# Altium schematic sheet BG95_Power.SchDoc: BG95 Power Domain
size A4; DocumentNumber: 17; SheetNumber: 17; SheetTotal: 50
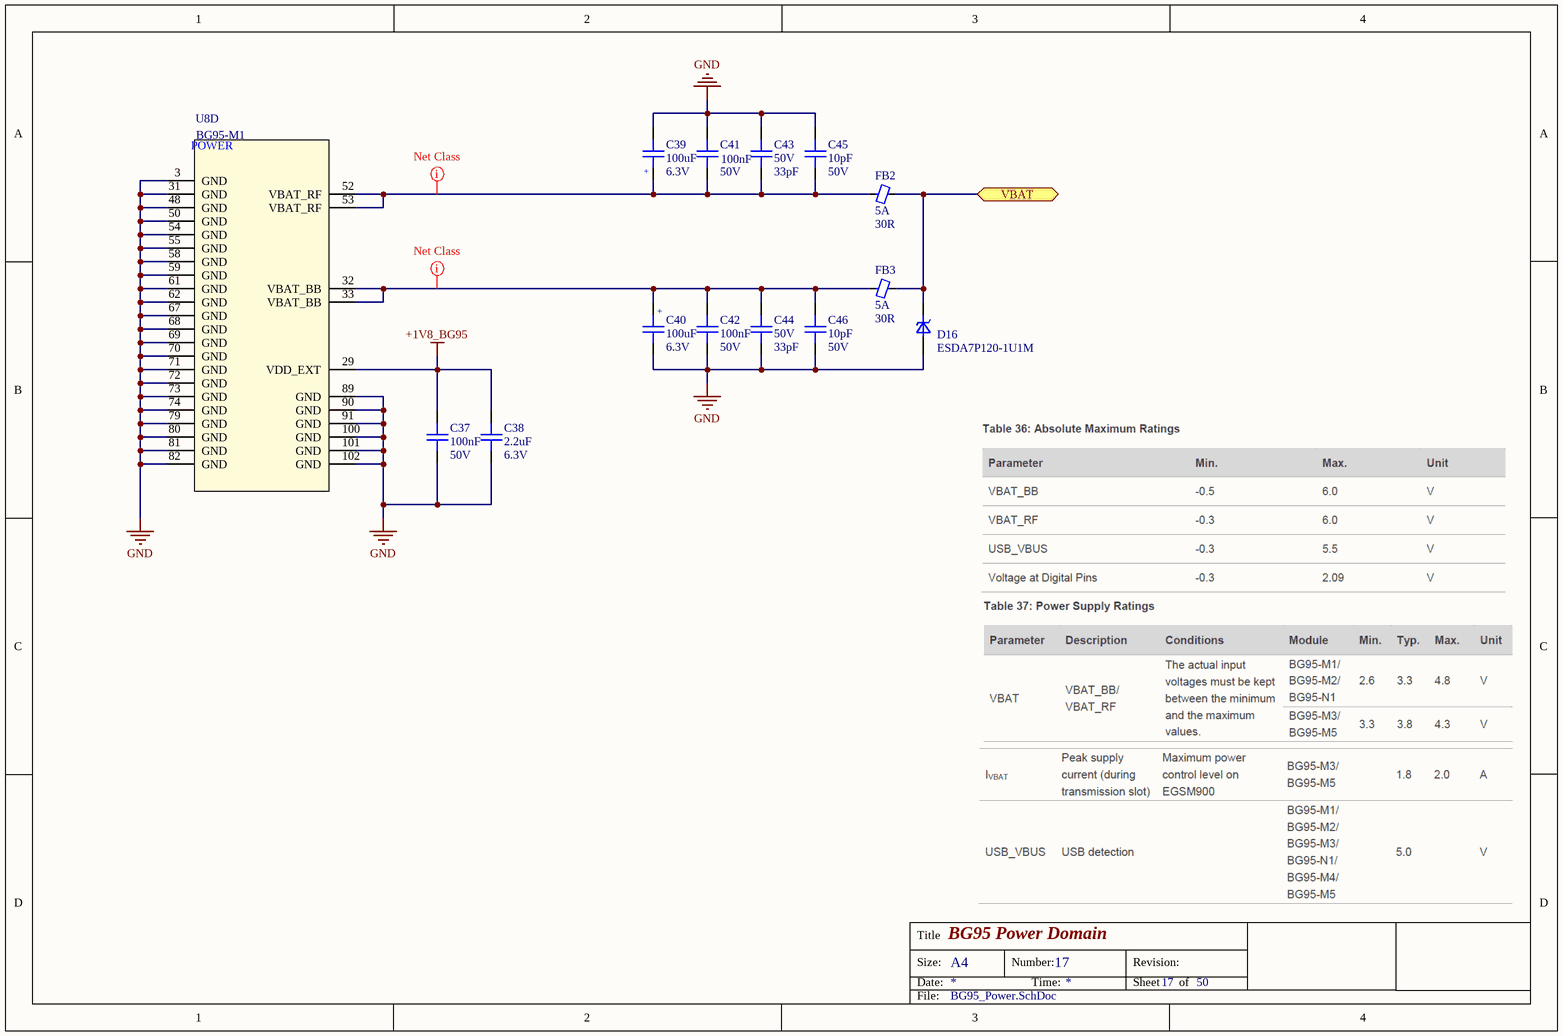
[diagram p0: BG95_Power.SchDoc]

## Parts
C37  Capacitance: 100nF  Voltage: 50V  [C0402]  (hidden comment: CAP CER 0.1UF 50V X7R 0402)
C38  Capacitance: 2.2uF  Voltage: 6.3V  [C0402]  (hidden comment: CAP CER 2.2UF 6.3V X5R 0402)
C39  Capacitance: 100uF  Voltage Rating: 6.3V  [WCAP-ASLI_5x5.5]  (hidden comment: CAP ALUM 100 UF 20% 6.3 V SMD)
C40  Capacitance: 100uF  Voltage Rating: 6.3V  [WCAP-ASLI_5x5.5]  (hidden comment: CAP ALUM 100 UF 20% 6.3 V SMD)
C41  Capacitance: 100nF  Voltage: 50V  [C0402]  (hidden comment: CAP CER 0.1UF 50V X7R 0402)
C42  Capacitance: 100nF  Voltage: 50V  [C0402]  (hidden comment: CAP CER 0.1UF 50V X7R 0402)
C43  Voltage Rating: 50V  Capacitance: 33pF  [C0402]  (hidden comment: CAP CER 33PF 50V C0G/NPO 0402)
C44  Voltage Rating: 50V  Capacitance: 33pF  [C0402]  (hidden comment: CAP CER 33PF 50V C0G/NPO 0402)
C45  Capacitance: 10pF  Voltage Rating: 50V  [C0402]  (hidden comment: CAP CER 10PF 50V C0G/NP0 0402)
C46  Capacitance: 10pF  Voltage Rating: 50V  [C0402]  (hidden comment: CAP CER 10PF 50V C0G/NP0 0402)
D16  ESDA7P120-1U1M  [ST_QFN_1610]
FB2  Current Rating: 5A  Impedance: 30R  [L0603]  (hidden comment: MPZ1608S300ATAH0)
FB3  Current Rating: 5A  Impedance: 30R  [L0603]  (hidden comment: MPZ1608S300ATAH0)
U8  BG95-M1  [BG95]  (part D of 6)

## Ports
VBAT

## Nets
+1V8_BG95: C37.2 C38.2 U8.29(VDD_EXT)
GND: C37.1 C38.1 C39.2 C40.2 C41.2 C42.1 C43.2 C44.1 C45.2 C46.1 D16.2(A) U8.3(GND) U8.31(GND) U8.48(GND) U8.50(GND) U8.54(GND) U8.55(GND) U8.58(GND) U8.59(GND) U8.61(GND) U8.62(GND) U8.67(GND) U8.68(GND) U8.69(GND) U8.70(GND) U8.71(GND) U8.72(GND) U8.73(GND) U8.74(GND) U8.79(GND) U8.80(GND) U8.81(GND) U8.82(GND) U8.89(GND) U8.90(GND) U8.91(GND) U8.100(GND) U8.101(GND) U8.102(GND)
VBAT: D16.1(K) FB2.2 FB3.2 ; port VBAT
NetC39_1: C39.1 C41.1 C43.1 C45.1 FB2.1 U8.52(VBAT_RF) U8.53(VBAT_RF)
NetC40_1: C40.1 C42.2 C44.2 C46.2 FB3.1 U8.32(VBAT_BB) U8.33(VBAT_BB)

## Layout directives
net class BG95_PWR: NetC39_1, NetC40_1

## Notes on the sheet
- Title
- Size:
- Date:
- A4
- Number:
- Time:
- Revision:
- Sheet
- of
- File:
- (in symbol CAP ALUM 100 UF 20% 6.3 V SMD) +
- (in symbol MOD BG95 RX TXRX CELLULAR LTE/NAV SMD, part D) POWER

## Library data of the parts
C37 C41 C42 = CAP CER 0.1UF 50V X7R 0402: 0.1µF ±10% 50V Ceramic Capacitor X7R 0402 (1005 Metric); Manufacturer: TDK; Manufacturer Part Number: CGA2B3X7R1H104K050BB; Supplier 1: Digi-Key; Stock 1: 2925303; Pricing 1: 1=0.17, 10=0.118, 50=0.0668, 100=0.0553, 500=0.0388, 1000=0.0321, 2500=0.0299, 5000=0.0273 (USD); Mount: Surface Mount; Case/Package: 0402; Weight: 2.3E-05oz; Case Code (Metric): 1005; Case Code (Imperial): 0402; Min Operating Temperature: -55°C; Max Operating Temperature: 125°C; Voltage Rating: 50V; Tolerance: 10%; Packaging: Tape and Reel; Package Quantity: 1; Voltage Rating (DC): 50V; Dielectric: X7R; Termination: SMD/SMT; Composition: Ceramic; Length: 1mm; Height: 0.5mm; Width: 0.02inch; Thickness: 0.022inch; Depth: 0.5mm; Ratings: AEC-Q200; REACH SVHC: No SVHC; Lead Free: Lead Free; ComponentLink1URL: http://product.tdk.com/capacitor/mlcc/en/documents/mlccspec_automotive_general_midvoltage_en.pdf?src-supplier=Future+Electronics; ComponentLink1Description: http://product.tdk.com/capacitor/mlcc/en/documents/mlccspec_automotive_general_midvoltage_en.pdf?src-supplier=Future+Electronics; ComponentLink2URL: http://www.farnell.com/datasheets/1807242.pdf?src-supplier=Element14; ComponentLink2Description: http://www.farnell.com/datasheets/1807242.pdf?src-supplier=Element14; ComponentLink3URL: http://www.mouser.com/ds/2/400/lcc_automotive_general_en-843974.pdf?src-supplier=Mouser; ComponentLink3Description: http://www.mouser.com/ds/2/400/lcc_automotive_general_en-843974.pdf?src-supplier=Mouser; ComponentLink4URL: http://www.farnell.com/datasheets/1936565.pdf?src-supplier=Element14; ComponentLink4Description: http://www.farnell.com/datasheets/1936565.pdf?src-supplier=Element14; ComponentLink5URL: http://www.farnell.com/datasheets/1735392.pdf?src-supplier=Element14; ComponentLink5Description: http://www.farnell.com/datasheets/1735392.pdf?src-supplier=Element14; Supplier Part Number 1: 445-6899-1-ND; ClassName: P109
C38 = CAP CER 2.2UF 6.3V X5R 0402: 2.2µF ±20% 6.3V Ceramic Capacitor X5R 0402 (1005 Metric); Manufacturer: Murata; Manufacturer Part Number: GRM155R60J225ME15D; Supplier 1: Digi-Key; Stock 1: 4444410; Pricing 1: 1=0.29, 10=0.199, 100=0.1009, 500=0.0691, 1000=0.0611, 2500=0.0584, 5000=0.0531 (USD); Mount: Surface Mount; Case/Package: 0402; Case Code (Metric): 1005; Case Code (Imperial): 0402; Min Operating Temperature: -55°C; Max Operating Temperature: 85°C; Voltage Rating: 6.3V; Tolerance: 20%; Packaging: Tape and Reel; Package Quantity: 10000; Voltage Rating (DC): 6.3V; Dielectric: X5R; Termination: SMD/SMT; Length: 1mm; Height: 0.5mm; Width: 0.02inch; Thickness: 0.022inch; Depth: 0.5mm; REACH SVHC: No SVHC; Lead Free: Lead Free; ComponentLink1URL: https://www.murata.com/~/media/webrenewal/support/library/catalog/products/capacitor/mlcc/c02e.ashx?la=en-us&src-supplier=Digi-Key; ComponentLink1Description: https://www.murata.com/~/media/webrenewal/support/library/catalog/products/capacitor/mlcc/c02e.ashx?la=en-us&src-supplier=Digi-Key; ComponentLink2URL: http://www.murata.com/~/media/webrenewal/support/library/catalog/products/capacitor/mlcc/c02e.ashx?src-supplier=Avnet; ComponentLink2Description: http://www.murata.com/~/media/webrenewal/support/library/catalog/products/capacitor/mlcc/c02e.ashx?src-supplier=Avnet; ComponentLink3URL: http://www.farnell.com/datasheets/2047859.pdf?src-supplier=Element14; ComponentLink3Description: http://www.farnell.com/datasheets/2047859.pdf?src-supplier=Element14; ComponentLink4URL: https://produktinfo.conrad.com/datenblaetter/450000-474999/450128-da-01-de-VS_KONDENS_GRM155_R60J_225ME15D.pdf?src-supplier=Conrad; ComponentLink4Description: https://produktinfo.conrad.com/datenblaetter/450000-474999/450128-da-01-de-VS_KONDENS_GRM155_R60J_225ME15D.pdf?src-supplier=Conrad; Supplier Part Number 1: 490-4519-1-ND; Material: Ceramic; Radiation Hardening: No; ClassName: P109
C39 C40 = CAP ALUM 100 UF 20% 6.3 V SMD: 100µF 6.3V Aluminum Electrolytic Capacitors Radial, Can - SMD  2000 Hrs @ 105°C; Manufacturer: Wurth Elektronik; Manufacturer Part Number: 865080142007; Ripple Current: 170mA; Life (Hours): 2000Hour; Leakage Current: 6.3uA; Dissipation Factor: 24%; Endurance: 2000h; Capacitance Tolerance: +/-20%; Technical Reference: ASEC055101M6R3DVCTBB000; Polarity: Polar; Impedance: 800mR; Supplier 1: Digi-Key; Stock 1: 2227; Pricing 1: 1=0.2, 50=0.167, 100=0.145, 250=0.129, 500=0.113 (USD); Mount: Surface Mount; Case/Package: Radial; Min Operating Temperature: -55°C; Max Operating Temperature: 105°C; Package Quantity: 1000; Packaging: Tape and Reel; Tolerance: 20%; Height - Seated (Max): 0.217inch; ComponentLink1URL: http://www.we-online.de; ComponentLink1Description: Manufacturer; Supplier Part Number 1: 732-8472-1-ND; Ripple Current (AC): 170mA; Voltage Rating (DC): 6.3V; Diameter: 5mm; Height: 5.5mm; REACH SVHC: Unknown; ComponentLink2URL: https://www.we-online.com/catalog/datasheet/865080142007.pdf; ComponentLink2Description: Datasheet; Mounting Technology: SMT; Operating Temperature: -55 to +105degC; Published Date: May 2020; ComponentLink3URL: http://www.farnell.com/datasheets/1880090.pdf?src-supplier=Farnell; ComponentLink3Description: http://www.farnell.com/datasheets/1880090.pdf?src-supplier=Farnell; ComponentLink4URL: http://www.farnell.com/datasheets/1880090.pdf?src-supplier=Newark; ComponentLink4Description: http://www.farnell.com/datasheets/1880090.pdf?src-supplier=Newark; ComponentLink5URL: http://katalog.we-online.de/pbs/datasheet/865080142007.pdf?src-supplier=Digi-Key; ComponentLink5Description: http://katalog.we-online.de/pbs/datasheet/865080142007.pdf?src-supplier=Digi-Key; ComponentLink6URL: http://www.farnell.com/datasheets/1880090.pdf?src-supplier=Element14; ComponentLink6Description: http://www.farnell.com/datasheets/1880090.pdf?src-supplier=Element14; ComponentLink7URL: https://katalog.we-online.de/pbs/datasheet/865080142007.pdf?src-supplier=Digi-Key; ComponentLink7Description: https://katalog.we-online.de/pbs/datasheet/865080142007.pdf?src-supplier=Digi-Key; ClassName: P109
C43 C44 = CAP CER 33PF 50V C0G/NPO 0402: 33pF ±5% 50V Ceramic Capacitor C0G, NP0 0402 (1005 Metric); Manufacturer: Yageo; Manufacturer Part Number: CC0402JRNPO9BN330; Insulation Resistance: 100GR; Supplier 1: Digi-Key; Stock 1: 622219; Pricing 1: 1=0.1, 10=0.022, 100=0.0099, 500=0.0071, 1000=0.0056, 2500=0.0051, 5000=0.0047 (USD); Mount: Surface Mount; Number of Pins: 2; Weight: 2.3E-05oz; Case Code (Imperial): 0402; Case Code (Metric): 1005; Dielectric Material: Ceramic; Min Operating Temperature: -55°C; Max Operating Temperature: 125°C; Tolerance: 5%; Dielectric: C0G; Voltage Rating (DC): 50V; Packaging: Tape and Reel; Package Quantity: 1; Termination: SMD/SMT; Composition: Ceramic; Length: 1mm; Height: 0.5mm; Depth: 0.5mm; Width: 0.5mm; Thickness: 0.022inch; Radiation Hardening: No; REACH SVHC: No SVHC; Lead Free: Lead Free; ComponentLink1URL: https://www.verical.com/server-webapp/html/getDatasheet?partID=403453&src-supplier=Verical; ComponentLink1Description: https://www.verical.com/server-webapp/html/getDatasheet?partID=403453&src-supplier=Verical; ComponentLink2URL: http://www.farnell.com/datasheets/2213336.pdf?src-supplier=Element14; ComponentLink2Description: http://www.farnell.com/datasheets/2213336.pdf?src-supplier=Element14; ComponentLink3URL: http://www.mouser.com/ds/2/447/Yageo_UPY-GP_NP0_16V-to-50V_9-358835.pdf?src-supplier=Mouser; ComponentLink3Description: http://www.mouser.com/ds/2/447/Yageo_UPY-GP_NP0_16V-to-50V_9-358835.pdf?src-supplier=Mouser; ComponentLink4URL: http://www.yageo.com/documents/recent/UPY-GP_NP0_16V-to-50V_16.pdf?src-supplier=Digi-Key; ComponentLink4Description: http://www.yageo.com/documents/recent/UPY-GP_NP0_16V-to-50V_16.pdf?src-supplier=Digi-Key; ComponentLink5URL: http://www.yageo.com/documents/recent/UPY-GP_NP0_16V-to-50V_8.pdf?src-supplier=Avnet+Europe; ComponentLink5Description: http://www.yageo.com/documents/recent/UPY-GP_NP0_16V-to-50V_8.pdf?src-supplier=Avnet+Europe; Supplier Part Number 1: 311-1020-1-ND; Case/Package: 0402; ClassName: P109
C45 C46 = CAP CER 10PF 50V C0G/NP0 0402: 10pF ±10% 50V Ceramic Capacitor C0G, NP0 0402 (1005 Metric); Manufacturer: KEMET; Manufacturer Part Number: C0402C100K5GACTU; Dissipation Factor: 0.1%; Supplier 1: Digi-Key; Stock 1: 57093; Pricing 1: 1=0.1, 10=0.021, 50=0.0116, 100=0.0095, 500=0.0068, 1000=0.0053, 2500=0.0048, 5000=0.0045 (USD); Mount: Surface Mount; Case/Package: 0402; Case Code (Metric): 1005; Case Code (Imperial): 0402; Dielectric Material: Ceramic; Min Operating Temperature: -55°C; Max Operating Temperature: 125°C; Tolerance: 10%; Packaging: Tape and Reel; Package Quantity: 10000; Voltage Rating (DC): 50V; Dielectric: C0G; Termination: SMD/SMT; Length: 1mm; Height: 0.5mm; Width: 0.02inch; Thickness: 0.022inch; Lead Pitch: 0.3mm; Depth: 0.5mm; Radiation Hardening: No; REACH SVHC: No SVHC; Lead Free: Lead Free; ComponentLink1URL: http://www.mouser.com/ds/2/212/KEM_C1003_C0G_SMD-1101588.pdf?src-supplier=Mouser; ComponentLink1Description: http://www.mouser.com/ds/2/212/KEM_C1003_C0G_SMD-1101588.pdf?src-supplier=Mouser; Supplier Part Number 1: 399-7747-1-ND; ClassName: P109
D16 = TVS DIODE ESDA7P120-1U1M 5.5V 11.5V 1610: 11.5V Clamp 120A (8/20µs) Ipp Tvs Diode Surface Mount 1610; Manufacturer: STMicroelectronics; Reverse Standoff Voltage: 5.5V; Number of Unidirectional Channels: 1; Min Breakdown Voltage: 6.4V; Peak Pulse Power: 1.4kW; Power Line Protection: No; Supplier 1: Digi-Key; Manufacturer Part Number: ESDA7P120-1U1M; Stock 1: 15775; Pricing 1: 1=0.35, 10=0.287, 25=0.2624, 100=0.1647, 250=0.1629, 500=0.1525, 1000=0.1037, 2500=0.0994 (USD); Packaging: Cut Tape; ComponentLink1URL: http://www.st.com/content/ccc/resource/technical/document/datasheet/group3/5e/7c/5d/76/3f/de/45/35/DM00359316/files/DM00359316.pdf/jcr:content/translations/en.DM00359316.pdf?src-supplier=Digi-Key; ComponentLink1Description: http://www.st.com/content/ccc/resource/technical/document/datasheet/group3/5e/7c/5d/76/3f/de/45/35/DM00359316/files/DM00359316.pdf/jcr:content/translations/en.DM00359316.pdf?src-supplier=Digi-Key; Supplier Part Number 1: 497-17159-1-ND; Mount: Surface Mount; Case/Package: 0603; Case Code (Imperial): 0603; Case Code (Metric): 1610; Min Operating Temperature: -55°C; Max Operating Temperature: 150°C; Composition: Zener; Clamping Voltage: 11.5V; Peak Pulse Current: 120A; ComponentLink2URL: http://www.farnell.com/datasheets/2815837.pdf?src-supplier=Newark; ComponentLink2Description: http://www.farnell.com/datasheets/2815837.pdf?src-supplier=Newark; ComponentLink3URL: http://www.farnell.com/datasheets/2815837.pdf?src-supplier=Farnell; ComponentLink3Description: http://www.farnell.com/datasheets/2815837.pdf?src-supplier=Farnell; ComponentLink4URL: http://www.farnell.com/datasheets/2815837.pdf?src-supplier=Element14; ComponentLink4Description: http://www.farnell.com/datasheets/2815837.pdf?src-supplier=Element14; ClassName: P109
FB2 FB3 = FERRITE BEAD 30 OHM 0603 1LN: 30 Ohms @ 100MHz 1 Power Line Ferrite Bead 0603 (1608 Metric) 5A 10mOhm; Manufacturer: TDK; Tolerance: 25%; DC Resistance (DCR): 10mR; Supplier 1: Digi-Key; Manufacturer Part Number: MPZ1608S300ATAH0; Stock 1: 93167; Pricing 1: 1=0.1, 10=0.079, 25=0.0716, 50=0.0644, 100=0.0472, 250=0.0343, 500=0.0315, 1000=0.0272 (USD); Case/Package: 0603; Case Code (Metric): 1608; Case Code (Imperial): 0603; Min Operating Temperature: -55°C; Max Operating Temperature: 125°C; Package Quantity: 4000; Packaging: Tape and Reel; Termination: SMD/SMT; Length: 0.063inch; Height: 0.6mm; Width: 0.031inch; Depth: 0.8mm; REACH SVHC: No SVHC; Lead Free: Lead Free; ComponentLink1URL: https://media.digikey.com/pdf/Data%20Sheets/TDK%20PDFs/MPZ_Series_Br.pdf?src-supplier=Digi-Key; ComponentLink1Description: https://media.digikey.com/pdf/Data%20Sheets/TDK%20PDFs/MPZ_Series_Br.pdf?src-supplier=Digi-Key; ComponentLink2URL: http://www.farnell.com/datasheets/1795297.pdf?src-supplier=Element14; ComponentLink2Description: http://www.farnell.com/datasheets/1795297.pdf?src-supplier=Element14; Supplier Part Number 1: 445-1562-6-ND; Max DC Current: 5A; Test Frequency: 100MHz; Revision: July-2002: Re-released for DXP Platform.; Mount: Surface Mount; Weight: 7.1E-05oz; Core Material: Ferrite; ClassName: P109
U8 = MOD BG95 RX TXRX CELLULAR LTE/NAV SMD: LTE Cat M1, LTE Cat NB2 and EGPRS Transceiver Module Antenna Not Included Surface Mount; Manufacturer: QUECTEL; Part Description: IC MODULE BG95 102-LGA 19.9x23.6mm H2.2mm RO; Geometry.Height: 2.2mm; Value: BG95; Manufacturer Part Number: BG95-M1; PCB DECAL: BG95; Mount: Surface Mount